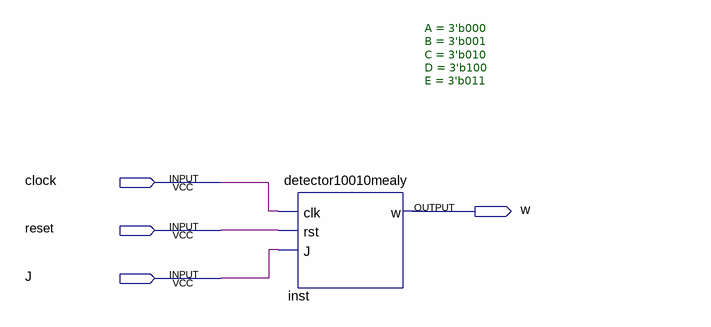
[diagram p0: schematic sheet]
// Quartus schematic Mealy_detector.bdf as structural Verilog: 1 symbols, 4 pins
module Mealy_detector (
  input  clock,
  input  reset,
  input  J,
  output w
);

  detector10010mealy #(.A(3'b000), .B(3'b001), .C(3'b010), .D(3'b100), .E(3'b011)) inst (
    .clk(clock), .rst(reset), .J(J));  // open: w
endmodule
